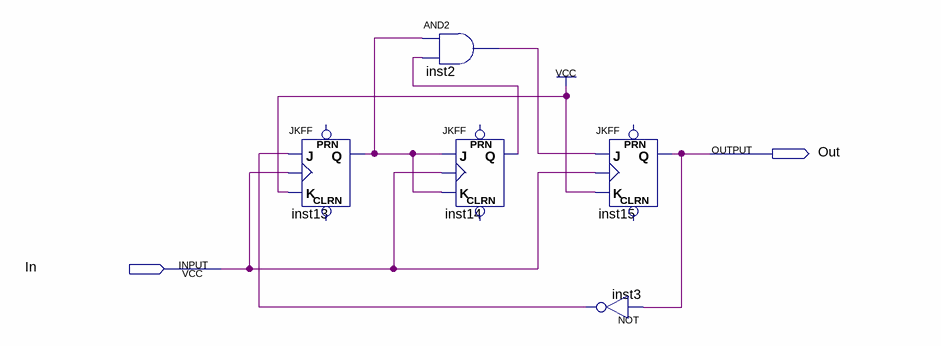
[diagram p0: schematic sheet]
// Quartus schematic Div_5.bdf as structural Verilog: 5 symbols, 2 pins
module Div_5 (
  input  In,
  output Out
);

  wire inst2_out, inst3_out, inst13_q, inst14_q;

  JKFF inst13 (.K(1'b1), .J(inst3_out), .CLK(In), .Q(inst13_q));  // open: PRN, CLRN
  and inst2 (inst2_out, inst13_q, inst14_q);
  JKFF inst14 (.K(inst13_q), .J(inst13_q), .CLK(In), .Q(inst14_q));  // open: PRN, CLRN
  JKFF inst15 (.K(1'b1), .J(inst2_out), .CLK(In), .Q(Out));  // open: PRN, CLRN
  not inst3 (inst3_out, Out);
endmodule
